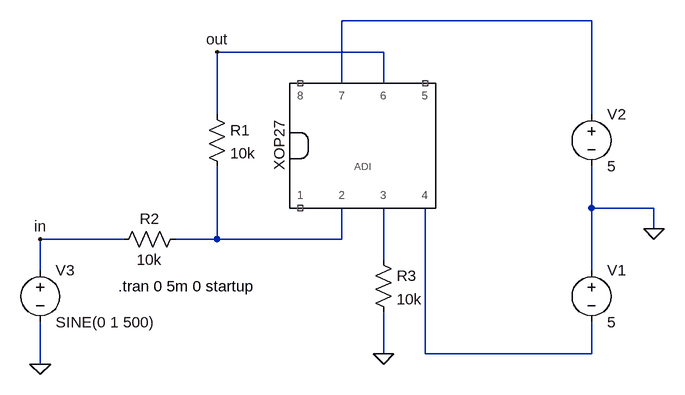
[diagram p0: schematic test-Dip-op27.asc]
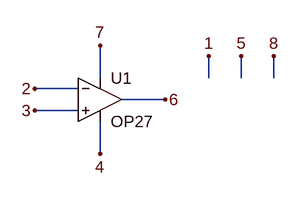
[diagram p1: sub-circuit dip-op27.asc]
test-Dip-op27.asc, the LTspice schematic file:
Version 4
SHEET 1 880 680
WIRE 592 -32 208 -32
WIRE 272 16 16 16
WIRE 208 64 208 -32
WIRE 272 64 272 16
WIRE 16 112 16 16
WIRE 592 112 592 -32
WIRE 592 256 592 192
WIRE 688 256 592 256
WIRE 688 288 688 256
WIRE -128 304 -256 304
WIRE 16 304 16 192
WIRE 16 304 -48 304
WIRE 208 304 208 256
WIRE 208 304 16 304
WIRE 272 336 272 256
WIRE -256 352 -256 304
WIRE 592 352 592 256
WIRE 272 480 272 416
WIRE 336 480 336 256
WIRE 592 480 592 432
WIRE 592 480 336 480
WIRE -256 496 -256 432
FLAG 688 288 0
FLAG 272 480 0
FLAG -256 496 0
FLAG 16 16 out
FLAG -256 304 in
SYMBOL res 0 96 R0
SYMATTR InstName R1
SYMATTR Value 10k
SYMBOL res -32 288 R90
WINDOW 0 0 56 VBottom 2
WINDOW 3 32 56 VTop 2
SYMATTR InstName R2
SYMATTR Value 10k
SYMBOL voltage 592 336 R0
SYMATTR InstName V1
SYMATTR Value 5
SYMBOL voltage 592 96 R0
SYMATTR InstName V2
SYMATTR Value 5
SYMBOL res 256 320 R0
SYMATTR InstName R3
SYMATTR Value 10k
SYMBOL voltage -256 336 R0
WINDOW 123 0 0 Left 0
WINDOW 39 0 0 Left 0
SYMATTR InstName V3
SYMATTR Value SINE(0 1 500)
SYMBOL Dip-op27 352 160 R0
SYMATTR InstName XOP27
SYMATTR Value ""
TEXT -136 376 Left 2 !.tran 0 5m 0 startup

dip-op27.asc, the sub-circuit schematic file:
Version 4
SHEET 1 880 680
WIRE 288 128 288 80
WIRE 448 128 448 96
WIRE 496 128 496 96
WIRE 544 128 544 96
WIRE 256 144 192 144
WIRE 384 160 320 160
WIRE 256 176 192 176
WIRE 288 240 288 192
FLAG 288 80 7
FLAG 288 240 4
FLAG 384 160 6
FLAG 192 144 2
FLAG 192 176 3
FLAG 448 96 1
FLAG 496 96 5
FLAG 544 96 8
SYMBOL OpAmps\\OP27 288 96 R0
SYMATTR InstName U1

The netlist it stands for:
* test-Dip-op27.asc
R1 out N002 10k
R2 N002 in 10k
V1 0 N004 5
V2 N001 0 5
R3 N003 0 10k
V3 in 0 SINE(0 1 500)
XXOP27 NC_01 N002 N003 N004 NC_02 out N001 NC_03 dip-op27

* block symbol definitions
.subckt dip-op27 1 2 3 4 5 6 7 8
XU1 3 2 7 4 6 OP27  ; pins In+ In- V+ V- OUT
.ends dip-op27

.tran 0 5m 0 startup
.lib ADI.lib
.backanno
.end